# Altium schematic sheet channel78.SchDoc
size A4
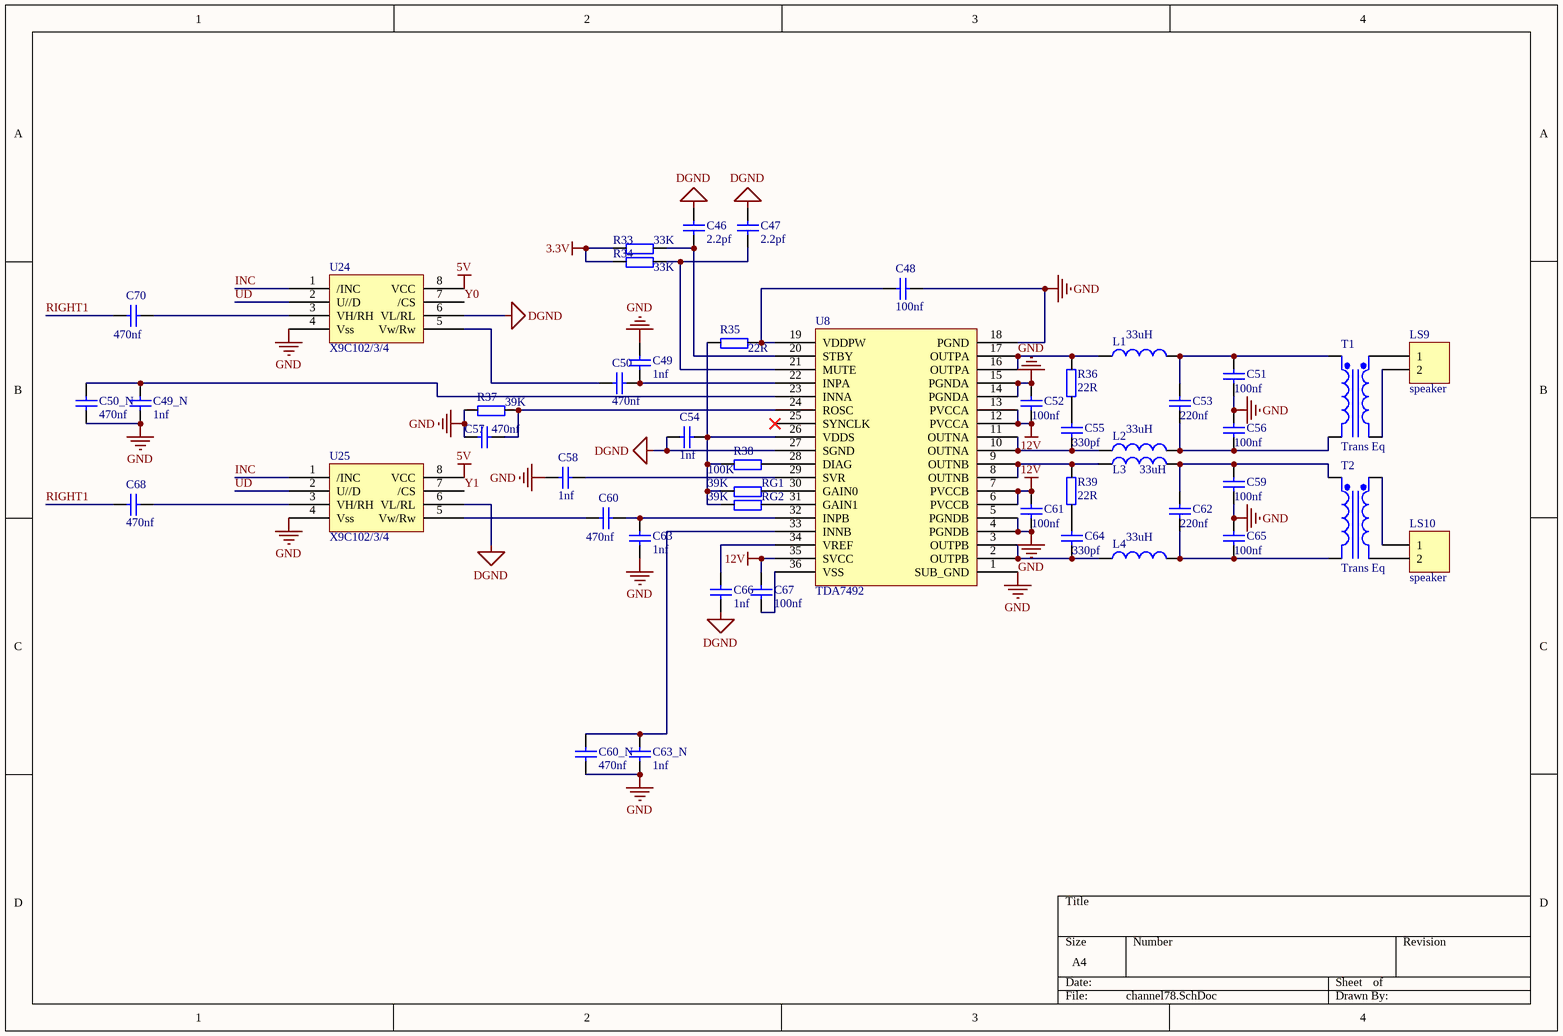
[diagram p0: channel78.SchDoc]

## Parts
C46  2.2pf  [0805C]
C47  2.2pf  [0805C]
C48  100nf  [0805C]
C49  1nf  [0805C]
C49_N  1nf  [0805C]
C50  470nf  [0805C]
C50_N  470nf  [0805C]
C51  100nf  [0805C]
C52  100nf  [0805C]
C53  220nf  [0805C]
C54  1nf  [0805C]
C55  330pf  [0805C]
C56  100nf  [0805C]
C57  470nf  [0805C]
C58  1nf  [0805C]
C59  100nf  [0805C]
C60  470nf  [0805C]
C60_N  470nf  [0805C]
C61  100nf  [0805C]
C62  220nf  [0805C]
C63  1nf  [0805C]
C63_N  1nf  [0805C]
C64  330pf  [0805C]
C65  100nf  [0805C]
C66  1nf  [0805C]
C67  100nf  [0805C]
C68  470nf  [0805C]
C70  470nf  [0805C]
L1  33uH  [L-7X7S]
L2  33uH  [L-7X7S]
L3  33uH  [L-7X7S]
L4  33uH  [L-7X7S]
LS9  speaker  [耳机座]
LS10  speaker  [耳机座]
R33  33K  [0805R]
R34  33K  [0805R]
R35  22R  [0805R]
R36  22R  [0805R]
R37  39K  [0805R]
R38  100K  [0805R]
R39  22R  [0805R]
RG1  39K  [0805R]
RG2  39K  [0805R]
T1  Trans Eq  [Transistor]
T2  Trans Eq  [Transistor]
U8  TDA7492  [POWERSSO-36]
U24  X9C102/3/4  [sop_8]
U25  X9C102/3/4  [sop_8]

## Nets
3.3V: R33.1 R34.1
5V: U24.8(VCC) U25.8(VCC)
12V: C52.2 C61.1 C67.2 U8.6(PVCCB) U8.7(PVCCB) U8.12(PVCCA) U8.13(PVCCA) U8.35(SVCC)
DGND: C46.2 C47.1 C54.2 C66.2 U8.27(SGND) U24.6(VL/RL) U25.6(VL/RL)
GND: C48.1 C49.2 C49_N.1 C50_N.1 C51.2 C52.1 C56.1 C57.1 C58.2 C59.2 C60_N.1 C61.2 C63.2 C63_N.2 C65.1 R37.1 U8.1(SUB_GND) U8.4(PGNDB) U8.5(PGNDB) U8.14(PGNDA) U8.15(PGNDA) U8.18(PGND) U24.4(Vss) U25.4(Vss)
INC: U24.1(/INC) U25.1(/INC)
RIGHT1: C68.2 C70.1
UD: U24.2(U//D) U25.2(U//D)
Y0: U24.7(/CS)
Y1: U25.7(/CS)
NetC46_1: C46.1 R33.2 U8.20(STBY)
NetC47_2: C47.2 R34.2 U8.21(MUTE)
NetC48_2: C48.2 R35.2 U8.19(VDDPW)
NetC49_1: C49.1 C50.2 U8.22(INPA)
NetC49_N_2: C49_N.2 C50_N.2 U8.23(INNA)
NetC50_1: C50.1 U24.5(Vw/Rw)
NetC51_1: C51.1 C53.1 L1.2 T1.1(Pri+)
NetC53_2: C53.2 C56.2 L2.2 T1.2(Pri-)
NetC54_1: C54.1 R35.1 R38.1 RG1.1 RG2.1 U8.26(VDDS)
NetC55_1: C55.1 R36.2
NetC55_2: C55.2 L2.1 U8.10(OUTNA) U8.11(OUTNA)
NetC57_2: C57.2 R37.2 U8.24(ROSC)
NetC58_1: C58.1 U8.29(SVR)
NetC59_1: C59.1 C62.1 L3.2 T2.1(Pri+)
NetC60_1: C60.1 U25.5(Vw/Rw)
NetC60_2: C60.2 C63.1 U8.32(INPB)
NetC60_N_2: C60_N.2 C63_N.1 U8.33(INNB)
NetC62_2: C62.2 C65.2 L4.2 T2.2(Pri-)
NetC64_1: C64.1 R39.2
NetC64_2: C64.2 L4.1 U8.2(OUTPB) U8.3(OUTPB)
NetC66_1: C66.1 U8.34(VREF)
NetC67_1: C67.1 U8.36(VSS)
NetC68_1: C68.1 U25.3(VH/RH)
NetC70_2: C70.2 U24.3(VH/RH)
NetL1_1: L1.1 R36.1 U8.16(OUTPA) U8.17(OUTPA)
NetL3_1: L3.1 R39.1 U8.8(OUTNB) U8.9(OUTNB)
NetLS9_1: LS9.1 T1.3(Sec+)
NetLS9_2: LS9.2 T1.4(Sec-)
NetLS10_1: LS10.1 T2.3(Sec+)
NetLS10_2: LS10.2 T2.4(Sec-)
NetR38_2: R38.2 U8.28(DIAG)
NetRG1_2: RG1.2 U8.30(GAIN0)
NetRG2_2: RG2.2 U8.31(GAIN1)

Not connected (* = marked no-connect by the designer): U8 25(SYNCLK)*

## Library data of the parts
C46-C49 C49_N C50 C50_N C51-C60 C60_N C61-C63 C63_N C64-C68 C70 = Cap: Capacitor; Value: 0.1uF; Published: 8-Jun-2000; LatestRevisionDate: 17-Jul-2002; LatestRevisionNote: Re-released for DXP Platform.; PackageReference: RAD-0.3; Publisher: Altium Limited; PackageDescription: Radial Cap, Thru-Hole; 2 Leads; 0.3 in Pin Spacing
L1-L4 = Inductor: Code_IEC: 1005; Published: 8-Jun-2000; LatestRevisionDate: 29-May-2009; LatestRevisionNote: IPC-7351 Footprint Added.; PackageReference: 0402-A; Publisher: Altium Limited; PackageDescription: Chip Inductor; Code_JEITA: 0402
LS9 LS10 = Header 2: Header, 2-Pin; LatestRevisionDate: 17-Jul-2002; LatestRevisionNote: Re-released for DXP Platform.; Publisher: Altium Limited
R33-R39 RG1 RG2 = R
T1 T2 = Trans Eq: Transformer (Equivalent Circuit Model); Published: 8-Jun-2000; LatestRevisionDate: 17-Jul-2002; LatestRevisionNote: Re-released for DXP Platform.; PackageReference: TRF_4; Publisher: Altium Limited; PackageDescription: Transformer; 4 Leads